# Altium schematic sheet TP_IHM_BUZZER.SchDoc
size A4
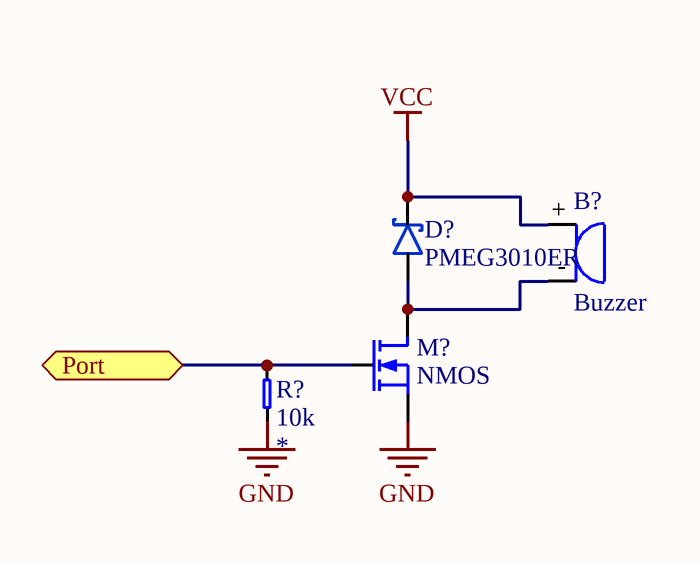
[diagram p0: TP_IHM_BUZZER.SchDoc]

## Parts
B?  Buzzer  [SD160709]
D?  PMEG3010ER  [SOD123W]
M?  NMOS  [MOSFET-SOT23]
R?  value 10k  [0402_RES_LD]  (hidden comment: Resistor)

## Ports
Port (bidir)

## Nets
GND: M?.S R?.2
VCC: B?.+ D?.K
Port: M?.G R?.1 ; port Port
NetB?_-: B?.- D?.A M?.D

## Library data of the parts
B? = SD160709: TDK SD160709 Buzzer; Reference: SD160709
D? = Schottky_PMEG3010ER: Nexperia 1A low Vf Mega Schottky barrier rectifier; Reference: PMEG3010ER
M? = N-MOSFET: N MOSFET
R? = Resistor: Precision: *; Package: *